# Altium project BNO_055_custom_board.PrjPcb
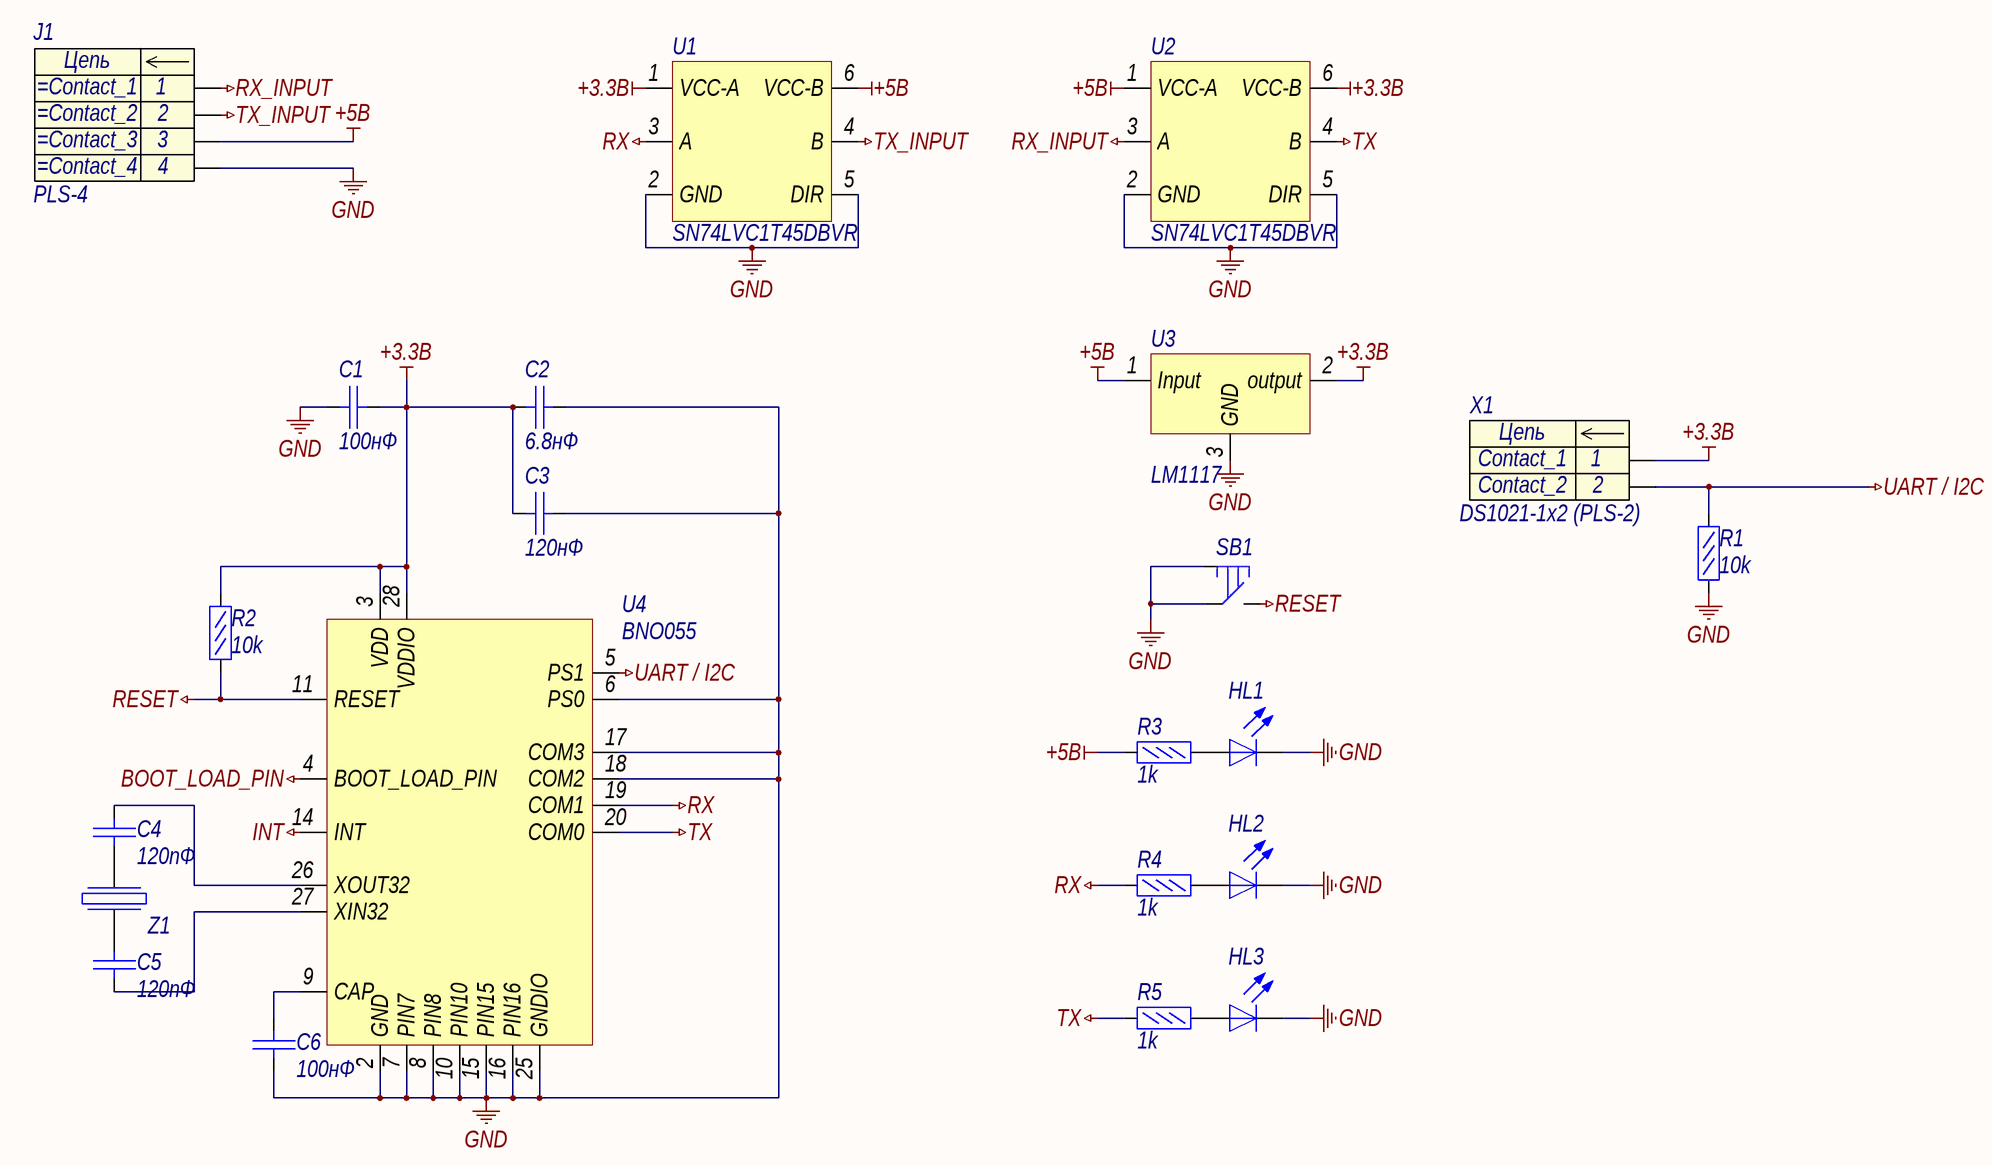
[diagram p0: Scheme.SchDoc]
1 sheet, 22 parts. Net scope: global (net labels, ports and power ports of the same name join across sheets).
Board file: mainboard.PcbDoc

## Sheet Scheme.SchDoc: =title_line_1 + title_line_2
size 1261 x 594 mm; SheetNumber: 1; SheetTotal: 1

### Parts
C1  100нФ  [C0603]
C2  6.8нФ  [C0603]
C3  120нФ  [C0603]
C4  120пФ  [C0603]
C5  120пФ  [C0603]
C6  100нФ  [C0603]
HL1  (no value)  [1206_LED_GREEN]
HL2  (no value)  [1206_LED_GREEN]
HL3  (no value)  [1206_LED_GREEN]
J1  PLS-4  [PLS-4]
R1  10k  [R0603]
R2  10k  [R0603]
R3  1k  [R0603]
R4  1k  [R0603]
R5  1k  [R0603]
SB1  (no value)  [1-1437565-6]
U1  SN74LVC1T45DBVR  [SOT23-6]
U2  SN74LVC1T45DBVR  [SOT23-6]
U3  LM1117  [SOT223_M]
U4  BNO055  [LGA60C50P10X6_520X380X118]
X1  DS1021-1x2 (PLS-2)  [PLS-2]
Z1  SMD_quartz_resonator_32.768kHz 3.2*1.5mm  [SMD_quartz_resonator_3.2*1.5]  (value not drawn)

### Nets
+3.3В: C1.1 C2.2 C3.2 R2.1 U1.1(VCC-A) U2.6(VCC-B) U3.2(output) U4.3(VDD) U4.28(VDDIO) X1.1
+5В: J1.3 R3.1 U1.6(VCC-B) U2.1(VCC-A) U3.1(Input)
BOOT_LOAD_PIN: U4.4(BOOT_LOAD_PIN)
GND: C1.2 C2.1 C3.1 C6.2 HL1.1(K) HL2.1(K) HL3.1(K) J1.4 R1.2 SB1.1 SB1.3(GND) U1.2(GND) U1.5(DIR) U2.2(GND) U2.5(DIR) U3.3(GND) U4.2(GND) U4.6(PS0) U4.7(PIN7) U4.8(PIN8) U4.10(PIN10) U4.15(PIN15) U4.16(PIN16) U4.17(COM3) U4.18(COM2) U4.25(GNDIO)
INT: U4.14(INT)
RESET: R2.2 SB1.2 U4.11(RESET)
RX: R4.1 U1.3(A) U4.19(COM1)
RX_INPUT: J1.1 U2.3(A)
TX: R5.1 U2.4(B) U4.20(COM0)
TX_INPUT: J1.2 U1.4(B)
UART / I2C: R1.1 U4.5(PS1) X1.2
NetC4_1: C4.1 Z1.2
NetC4_2: C4.2 U4.26(XOUT32)
NetC5_1: C5.1 U4.27(XIN32)
NetC5_2: C5.2 Z1.1
NetC6_1: C6.1 U4.9(CAP)
NetHL1_2: HL1.2(A) R3.2
NetHL2_2: HL2.2(A) R4.2
NetHL3_2: HL3.2(A) R5.2

### Notes on the sheet
- Подп. и дата
- Инв. № дубл.
- Взам. инв. №
- Инв. № подл.
- Лист
- Изм.
- № докум.
- Подп.
- Дата
- Копировал
- Формат
- A2x3
- (in symbol PLS-2) Цепь
- (in symbol PLS-4) Цепь

### Library data of the parts
C1-C6 = C0603: Конденсатор керамический 0603; Name: -; Manufacturer: -; TKE: -; Voltage: -
  C1 C6: Value: 100нФ
  C2: Value: 6.8нФ
  C3: Value: 120нФ
  C4 C5: Value: 120пФ
HL1-HL3 = LED: LED 1206; Manufacturer: KGB; Forward voltage; 25мА: 2,15В; Max. forward current (continuous): 25мА; Package: 0603
R1-R5 = Перемычка 0603: Name: Перемычка 0603
  R1 R2: Value: 10k
  R3-R5: Value: 1k
SB1 = Button: Normally open button / 1-1437565-6
U1 U2 = SN74LVC1T45DBVR: 1-битный шинный приемопередатчик с двуполярным питанием, тремя состояниями на выходе
U4 = BNO055: 9-ти осевой гироскоп, акселлерометр и магнитометр
X1 = PLS-2: Разъем - 2 конт. прямая вилка на плату, шаг 2,54 мм; Contact_1: Contact_1; Contact_2: Contact_2; Name: DS1021-1x2 (PLS-2)
Z1 = SMD_quartz_resonator_32.768kHz 3.2*1.5mm: резонатор кварцевый 32.768kHz